# EAGLE schematic Hip.SMD.V1 (EAGLE 7.1.0)
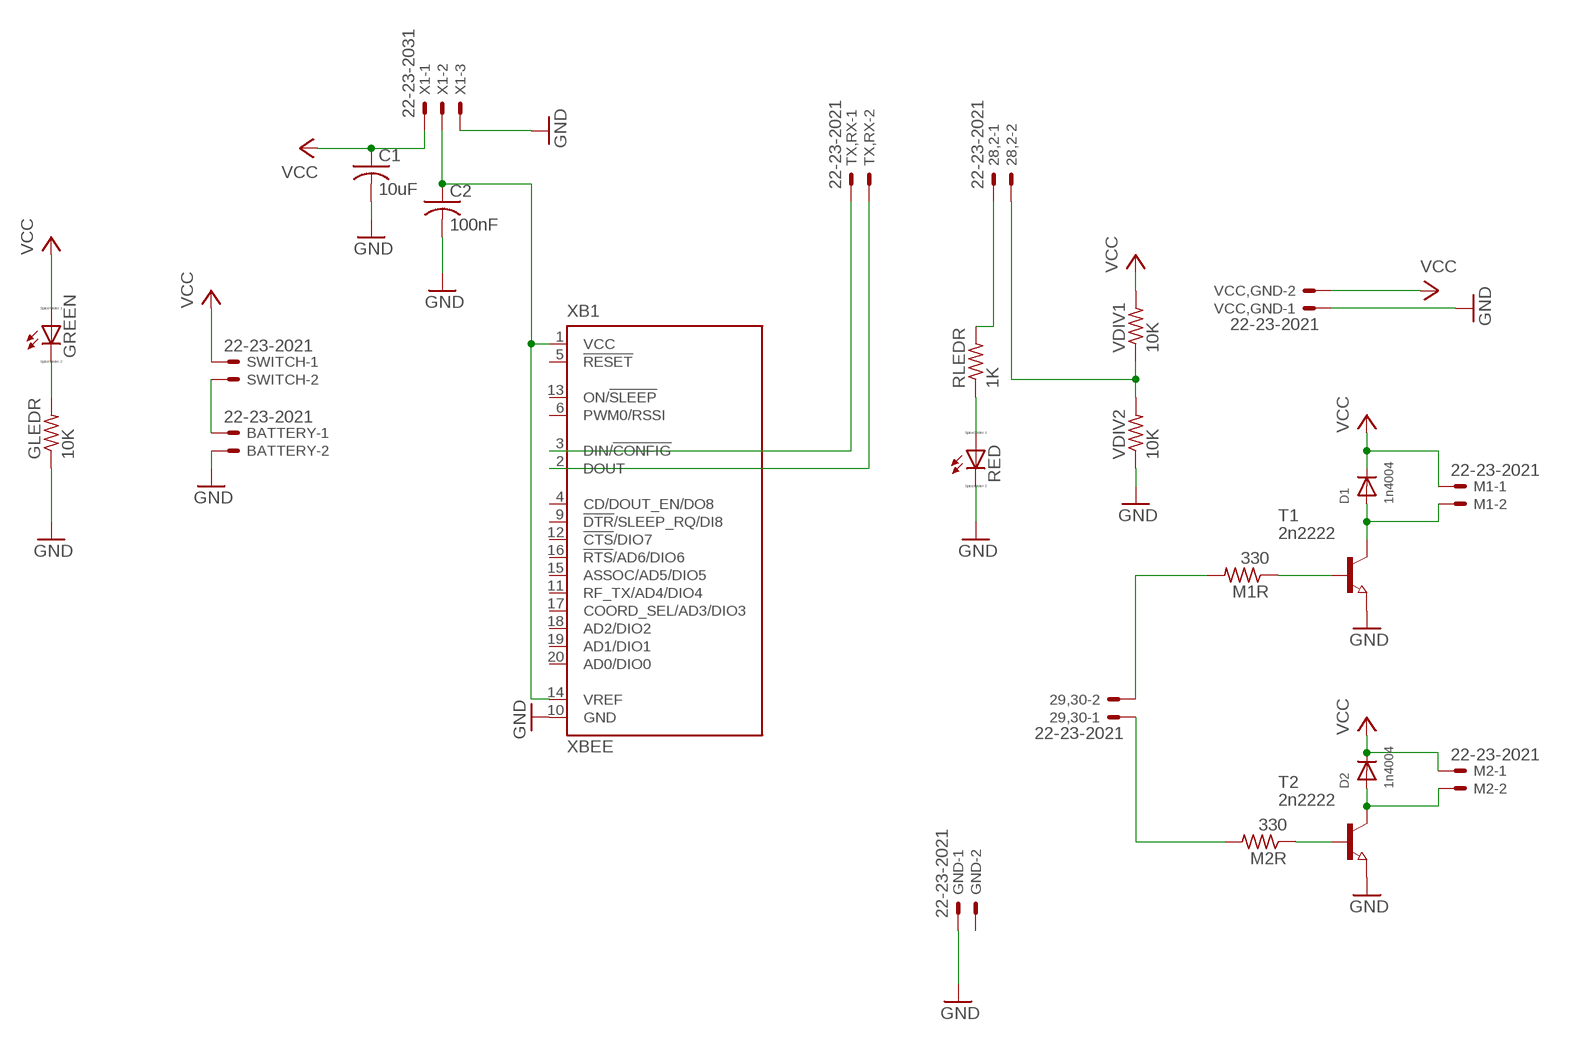
[diagram p0: schematic, sheet 1]

## Parts
28,2  22-23-2021  [22-23-2021]
29,30  22-23-2021  [22-23-2021]
BATTERY  22-23-2021  [22-23-2021]
C1  10uF  C-USC1206  [C1206]
C2  100nF  C-USC1206  [C1206]
D1  1n4004  DIODESMA  [SMADIODE]
D2  1n4004  DIODESMA  [SMADIODE]
GLEDR  10K  R-US_M1206  [M1206]
GND  22-23-2021  [22-23-2021]
GREEN  LED_E  [LED_1206]
M1  22-23-2021  [22-23-2021]
M1R  330  R-US_M1206  [M1206]
M2  22-23-2021  [22-23-2021]
M2R  330  R-US_M1206  [M1206]
RED  LED_E  [LED_1206]
RLEDR  1K  R-US_M1206  [M1206]
SWITCH  22-23-2021  [22-23-2021]
T1  2n2222  NPN-TRANSISTOR_SOT23  [SOT23]
T2  2n2222  NPN-TRANSISTOR_SOT23  [SOT23]
TX,RX  22-23-2021  [22-23-2021]
VCC,GND  22-23-2021  [22-23-2021]
VDIV1  10K  R-US_M1206  [M1206]
VDIV2  10K  R-US_M1206  [M1206]
X1  22-23-2031  [22-23-2031]
XB1  XBEE  [XBEE]

## Nets
GND: BATTERY.2 C1.2 C2.2 GLEDR.1 GND.1 RED.C T1.2(E) T2.2(E) VCC,GND.1 VDIV2.1 X1.3 XB1.10(GND)
N$1: RED.A RLEDR.1
N$2: GLEDR.2 GREEN.C
N$3: M1R.1 T1.1(B)
N$4: M2R.1 T2.1(B)
N$5: D2.A M2.2 T2.3(C)
N$6: D1.A M1.2 T1.3(C)
N$7: 28,2.2 VDIV1.1 VDIV2.2
N$8: BATTERY.1 SWITCH.2
N$9: C2.1 X1.2 XB1.1(VCC) XB1.14(VREF)
N$11: TX,RX.1 XB1.3(DIN/!CONFIG)
N$12: TX,RX.2 XB1.2(DOUT)
N$13: 28,2.1 RLEDR.2
N$14: 29,30.2 M1R.2
N$15: 29,30.1 M2R.2
VCC: C1.1 D1.C D2.C GREEN.A M1.1 M2.1 SWITCH.1 VCC,GND.2 VDIV1.2 X1.1
Unconnected: GND.2 XB1.4(CD/DOUT_EN/DO8) XB1.5(!RESET) XB1.6(PWM0/RSSI) XB1.9(!DTR!/SLEEP_RQ/DI8) XB1.11(RF_TX/AD4/DIO4) XB1.12(!CTS!/DIO7) XB1.13(ON/!SLEEP) XB1.15(ASSOC/AD5/DIO5) XB1.16(!RTS!/AD6/DIO6) XB1.17(COORD_SEL/AD3/DIO3) XB1.18(AD2/DIO2) XB1.19(AD1/DIO1) XB1.20(AD0/DIO0)

## Library data of the parts
28,2 29,30 BATTERY GND M1 M2 SWITCH TX,RX VCC,GND = con-molex:22-23-2021: .100" (2.54mm) Center Header - 2 Pin; MF: MOLEX; MPN: 22-23-2021; OC_FARNELL: 1462926; OC_NEWARK: 25C3832
C1 C2 = rcl:C-US: CAPACITOR, American symbol
D1 D2 = adafruit:DIODE: Diode SMADIODE - SMA Surface Mount Package 20V 1A Schottky Diode Digikey: 641-1014-6-ND DO-1N4148 - Through Hole Small Current Diode SOD-123 20V 1 A (.5mV Vf) Schottky Diode - Digikey: MBRX120TPMSCT-ND SOD-323 10V 570mA (.38mV Vf, 3ns) Schottky Diode - Digikey: ZLLS410CT-ND SOD-523 30V 30mA Schottky Diode (RB751S-40TE61) - Digikey: RB751S-40TE61CT-ND SOT23-R/W - SOT23 Package (R = Solder Paste/Reflow Ovens, W = Hand-Soldering) BAT54Film 40V 300mA - Digikey: 497-7162-1-ND
GLEDR M1R M2R RLEDR VDIV1 VDIV2 = rcl:R-US_: RESISTOR, American symbol
GREEN RED = eagle-ltspice:LED_E: LED Source: http://www.osram.convergy.de Source: www.luxeon.com Source: www.kingbright.com; SPICEMODEL: NONE; SPICEPREFIX: D; SPICETYPE: diode
T1 T2 = semicon-smd-ipc:NPN-TRANSISTOR_: NPN TRANSISTOR
X1 = con-molex:22-23-2031: .100" (2.54mm) Center Header - 3 Pin; MF: MOLEX; MPN: 22-23-2031; OC_FARNELL: 1462950; OC_NEWARK: 30C0862
XB1 = maxstream:XBEE: XBee (TM) /XBee-PRO(TM) OEM RF Modules Source: MaxStream, Inc. xbee_productmanual.pdf; MPN: XBP24-Z7UIT-004; OC_FARNELL: 1751799; OC_NEWARK: 34R5507